# Altium schematic sheet RSxxx для сумматора.SchDoc
size 209 x 297 mm; SheetNumber: 1; SheetTotal: 1; PageSetup: Record=PageOptions|CenterHorizontal=True|CenterVertical=True|PrintScale=0.95|XCorrection=1.00|YCorrection=1.00|PrintKind=2|BorderSize=5000000|LeftOffset=0|BottomOffset=0|Orientation=1|PaperLength=1000|PaperWidth=1000|Scale=100|PaperSource=15|PrintQuality=600|MediaType=1|DitherType=10|PaperKind=A4|PrintScaleMode=0; Razrabotal: Якубенко; Proveril: Мацкевич; Soglasoval: Радевич; N_Kontr: Папковский; Decimalnyi_nomer: ГЛЮИ.426477.008 Э3; Naimenovanie_dokumenta: Схема электрическая принципиальная; Pervichnoe_primenenie: ГЛЮИ.426477.008; DocumentName: Sheet1.SCHDOC
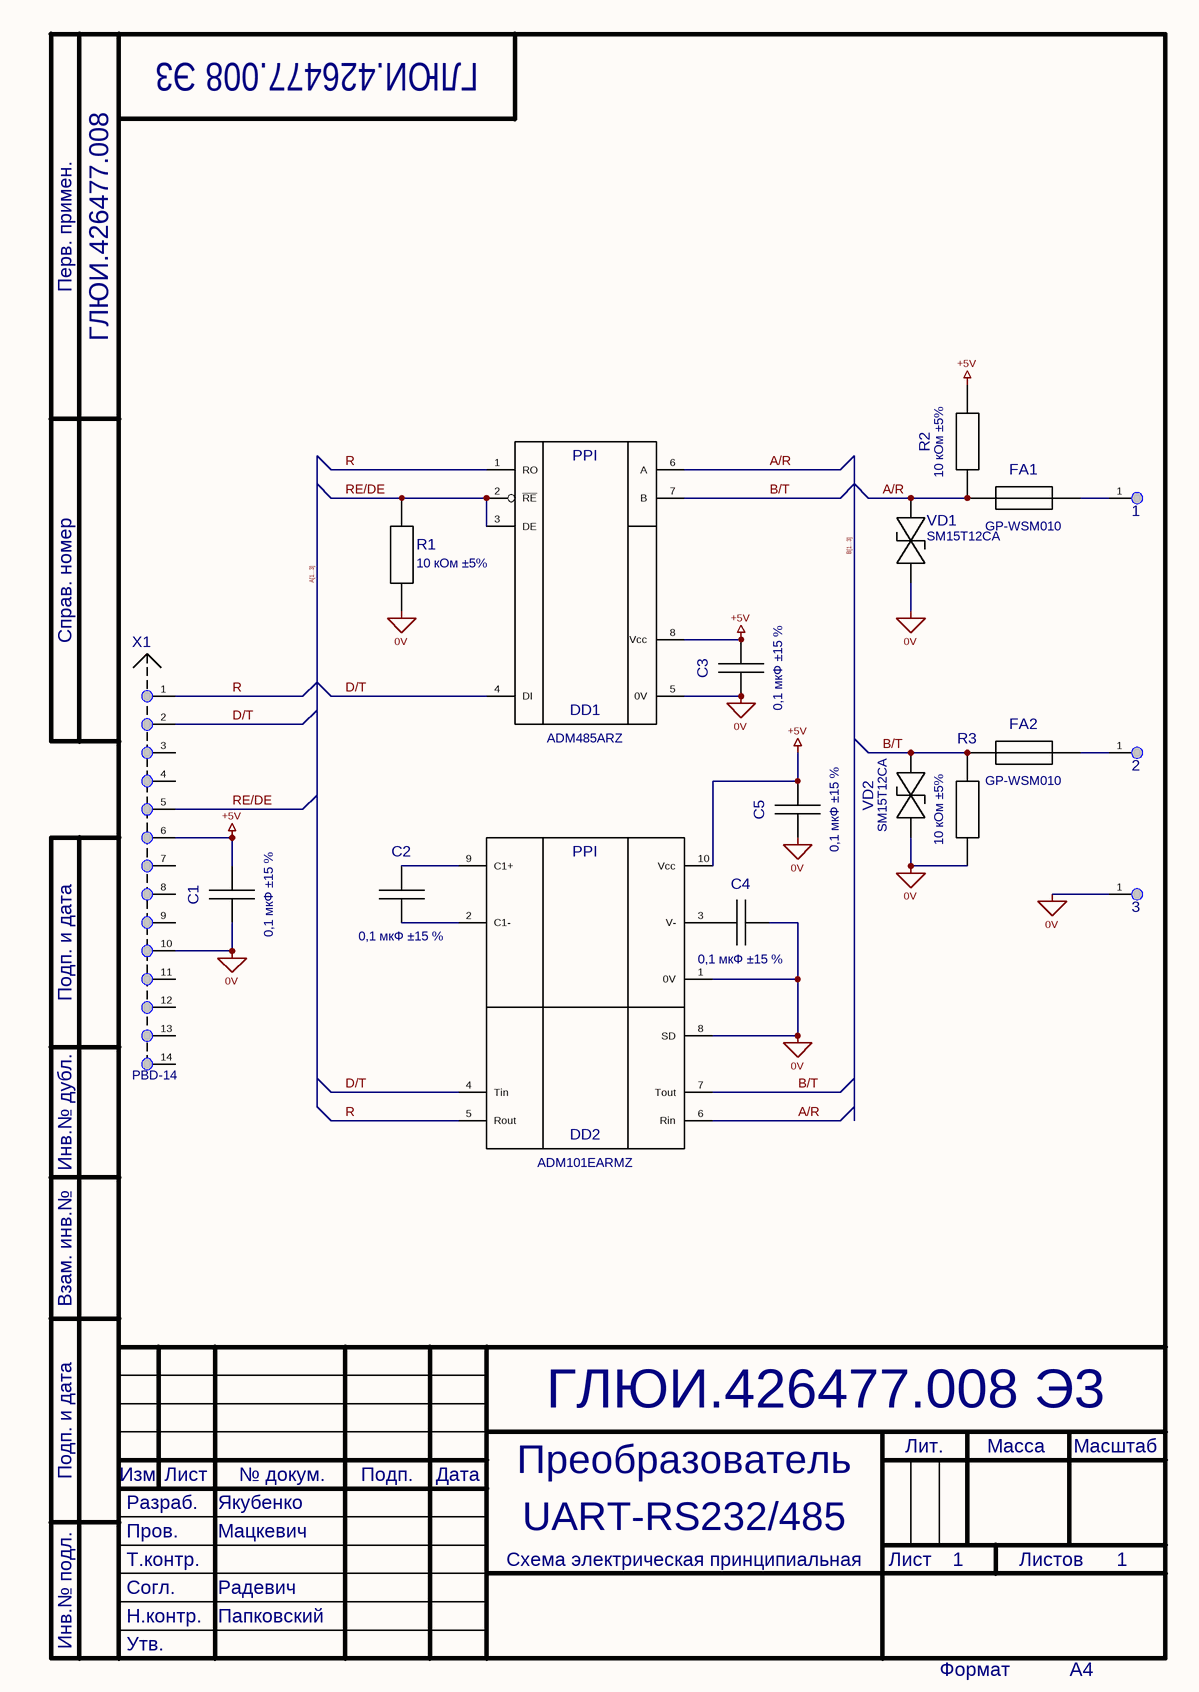
[diagram p0: RSxxx для сумматора.SchDoc]

## Parts
1  PAD D01,8 02,5x03.0  [PAD D01,8 02,5x03.0]  (value not drawn)
2  PAD D01,8 02,5x03.0  [PAD D01,8 02,5x03.0]  (value not drawn)
3  PAD D01,8 02,5x03.0  [PAD D01,8 02,5x03.0]  (value not drawn)
C1  value 0,1 мкФ ±15 %  [PAT0603]  (hidden comment: X7R 0603-50 В-0,1 мкФ±15 %)
C2  value 0,1 мкФ ±15 %  [PAT0603]  (hidden comment: X7R 0603-50 В-0,1 мкФ±15 %)
C3  value 0,1 мкФ ±15 %  [PAT0603]  (hidden comment: X7R 0603-50 В-0,1 мкФ±15 %)
C4  value 0,1 мкФ ±15 %  [PAT0603]  (hidden comment: X7R 0603-50 В-0,1 мкФ±15 %)
C5  value 0,1 мкФ ±15 %  [PAT0603]  (hidden comment: X7R 0603-50 В-0,1 мкФ±15 %)
DD1  ADM485ARZ  [SO-08 (150MIL)]
DD2  ADM101EARMZ  [SO-10 MIKRO]
FA1  GP-WSM010  [GP-WMS010]
FA2  GP-WSM010  [GP-WMS010]
R1  value 10 кОм ±5%  [PAT0603]  (hidden comment: 0603 0,1 Вт-10 кОм±5 %)
R2  value 10 кОм ±5%  [PAT0603]  (hidden comment: 0603 0,1 Вт-10 кОм±5 %)
R3  value 10 кОм ±5%  [PAT0603]  (hidden comment: 0603 0,1 Вт-10 кОм±5 %)
VD1  SM15T12CA  [SMC]
VD2  SM15T12CA  [SMC]
X1  PBD-14  [PBD-14]

## Nets
0V: 3.1 C1.1 C3.1 C4.1 C5.1 DD1.5(0V) DD2.1(0V) DD2.8(SD) R1.1 R3.1 VD1.1 VD2.1 X1.10
+5V: C1.2 C3.2 C5.2 DD1.8(Vcc) DD2.10(Vcc) R2.2 X1.6
A/R: DD1.6(A) DD2.6(Rin) FA1.1 R2.1 VD1.2
B/T: DD1.7(B) DD2.7(Tout) FA2.1 R3.2 VD2.2
D/T: DD1.4(DI) DD2.4(Tin) X1.2
R: DD1.1(RO) DD2.5(Rout) X1.1
RE/DE: DD1.2(~{RE}) DD1.3(DE) R1.2 X1.5
Net1_1: 1.1 FA1.2
Net2_1: 2.1 FA2.2
NetC2_1: C2.1 DD2.2(C1-)
NetC2_2: C2.2 DD2.9(C1+)
NetC4_2: C4.2 DD2.3(V-)

Not connected (* = marked no-connect by the designer): X1 3 4 7 8 9 11 12 13 14

## Buses and harness runs
bus A[1...3]
bus B[1...3]

## Notes on the sheet
- Преобразователь
- UART-RS232/485
- Перв. примен.
- Справ. номер
- Подп. и дата
- Инв.№ дубл.
- Взам. инв.№
- Разраб.
- Изм
- Лист
- № докум.
- Подп.
- Дата
- Лит.
- Масса
- Масштаб
- Пров.
- Т.контр.
- Листов
- Инв.№ подл.
- Н.контр.
- Утв.
- Согл.
- Формат
- А4
- (in symbol ADM101EARMZ) PPI
- (in symbol ADM485ARZ) PPI

## Library data of the parts
1-3 = PAD D01,8 02,5x03.0: Value: PAD D01,8 02,5x03.0
DD1 = ADM485ARZ: Value: ADM485ARZ
DD2 = ADM101EARMZ: Value: ADM101EARMZ
FA1 FA2 = GP-WSM010: Value: GP-WSM010
VD1 VD2 = SM15T12CA: Value: SM15T12CA
X1 = PBD-14: Value: PBD-14